# Altium schematic sheet MCU.SchDoc
size A3
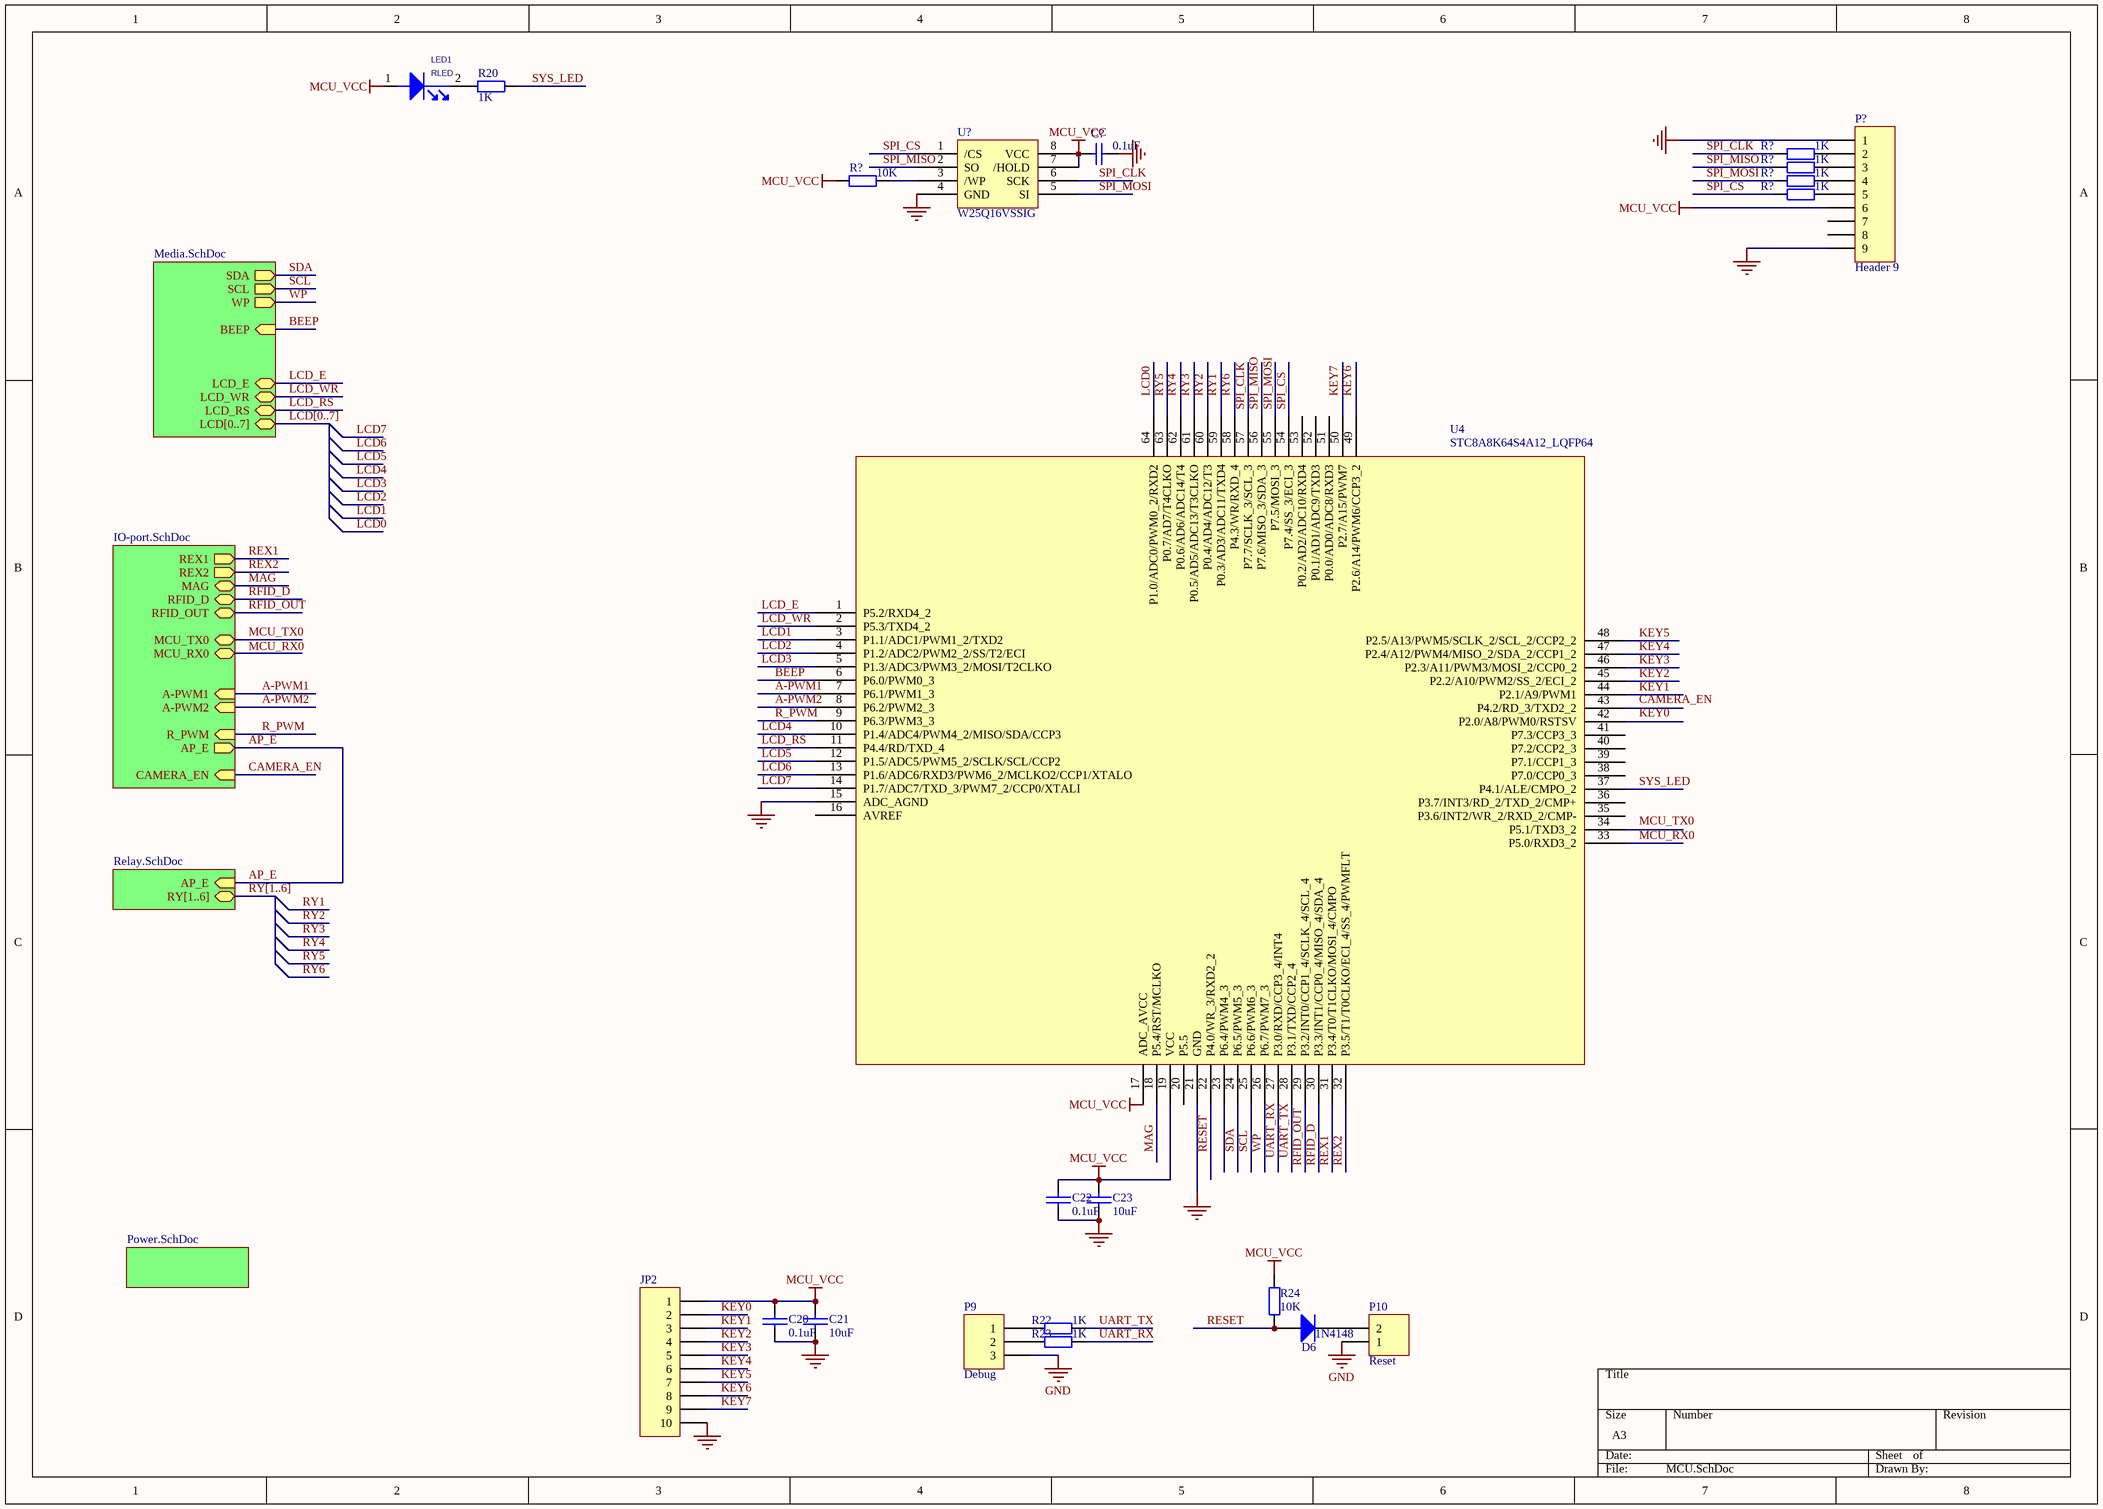
[diagram p0: MCU.SchDoc]

## Parts
(Parts that share a designator on the sheet are numbered #1, #2 ... from top to bottom, then left to right.)
C20  0.1uF  [C0603]
C21  10uF  [C0603]
C22  0.1uF  [C0603]
C23  10uF  [C0603]
C?  0.1uF  [C0603]
D6  1N4148  [SO-G2]
JP2  (no value)  [HDR1X10]
LED1  RLED  [L0603A]
P9  Debug  [HDR1X3]
P10  Reset  [HDR1X2]
P?  Header 9  [HDR1X9]
R20  value 1K  [R1608-0603]  (hidden comment: 10K)
R22  1K  [R1608-0603]
R23  1K  [R1608-0603]
R24  value 10K  [R0603]
R?#1  1K  [R0603]
R?#2  1K  [R0603]
R?#3  10K  [R0603]
R?#4  1K  [R0603]
R?#5  1K  [R0603]
U4  STC8A8K64S4A12_LQFP64  [LQFP64]
U?  W25Q16VSSIG  [SOP8L]

## Sub-sheets
IO-port = IO-port.SchDoc: REX1 (out), RFID_OUT, MAG, MCU_TX0, MCU_RX0, AP_E (out), CAMERA_EN (in), A-PWM1 (in), A-PWM2 (in), R_PWM (in), REX2 (out), RFID_D
Media = Media.SchDoc: SDA (out), SCL (out), WP (out), LCD_E (bidir), LCD_WR (bidir), LCD_RS (bidir), LCD[0..7] (bidir), BEEP (in)
Media = Power.SchDoc: no entries
Media = Relay.SchDoc: RY[1..6] (bidir), AP_E (in)

## Nets
GND: C20.2 C21.2 C22.2 C23.2 C?.1 JP2.10 P9.3 P10.1 P?.1 P?.9 U4.15(ADC_AGND) U4.21(GND) U?.4(GND)
MCU_VCC: C20.1 C21.1 C22.1 C23.1 C?.2 JP2.1 LED1.1(ANODE) P?.6 R24.1 R?#3.2 U4.17(ADC_AVCC) U4.19(VCC) U?.7(/HOLD) U?.8(VCC)
A-PWM1: U4.7(P6.1/PWM1_3) ; sheet IO-port/A-PWM1
A-PWM2: U4.8(P6.2/PWM2_3) ; sheet IO-port/A-PWM2
AP_E: sheet IO-port/AP_E, sheet Media/AP_E
BEEP: U4.6(P6.0/PWM0_3) ; sheet Media/BEEP
CAMERA_EN: sheet IO-port/CAMERA_EN
KEY0: JP2.2
KEY1: JP2.3 U4.44(P2.1/A9/PWM1)
KEY2: JP2.4 U4.45(P2.2/A10/PWM2/SS_2/ECI_2)
KEY3: JP2.5 U4.46(P2.3/A11/PWM3/MOSI_2/CCP0_2)
KEY4: JP2.6 U4.47(P2.4/A12/PWM4/MISO_2/SDA_2/CCP1_2)
KEY5: JP2.7 U4.48(P2.5/A13/PWM5/SCLK_2/SCL_2/CCP2_2)
KEY6: JP2.8
KEY7: JP2.9
LCD0: U4.64(P1.0/ADC0/PWM0_2/RXD2)
LCD1: U4.3(P1.1/ADC1/PWM1_2/TXD2)
LCD2: U4.4(P1.2/ADC2/PWM2_2/SS/T2/ECI)
LCD3: U4.5(P1.3/ADC3/PWM3_2/MOSI/T2CLKO)
LCD4: U4.10(P1.4/ADC4/PWM4_2/MISO/SDA/CCP3)
LCD5: U4.12(P1.5/ADC5/PWM5_2/SCLK/SCL/CCP2)
LCD6: U4.13(P1.6/ADC6/RXD3/PWM6_2/MCLKO2/CCP1/XTALO)
LCD7: U4.14(P1.7/ADC7/TXD_3/PWM7_2/CCP0/XTALI)
LCD_E: U4.1(P5.2/RXD4_2) ; sheet Media/LCD_E
LCD_RS: U4.11(P4.4/RD/TXD_4) ; sheet Media/LCD_RS
LCD_WR: U4.2(P5.3/TXD4_2) ; sheet Media/LCD_WR
MAG: U4.18(P5.4/RST/MCLKO) ; sheet IO-port/MAG
MCU_RX0: U4.33(P5.0/RXD3_2)
MCU_TX0: sheet IO-port/MCU_TX0
R_PWM: U4.9(P6.3/PWM3_3) ; sheet IO-port/R_PWM
RESET: D6.A R24.2 U4.22(P4.0/WR_3/RXD2_2)
REX1: U4.31(P3.4/T0/T1CLKO/MOSI_4/CMPO) ; sheet IO-port/REX1
REX2: U4.32(P3.5/T1/T0CLKO/ECI_4/SS_4/PWMFLT) ; sheet IO-port/REX2
RFID_D: U4.30(P3.3/INT1/CCP0_4/MISO_4/SDA_4) ; sheet IO-port/RFID_D
RFID_OUT: U4.29(P3.2/INT0/CCP1_4/SCLK_4/SCL_4) ; sheet IO-port/RFID_OUT
RY5: U4.63(P0.7/AD7/T4CLKO)
SCL: U4.25(P6.6/PWM6_3) ; sheet Media/SCL
SDA: U4.24(P6.5/PWM5_3) ; sheet Media/SDA
SPI_CLK: R?#1.2 U4.57(P7.7/SCLK_3/SCL_3) U?.6(SCK)
SPI_CS: R?#5.2 U?.1(/CS)
SPI_MISO: R?#2.2 U4.56(P7.6/MISO_3/SDA_3) U?.2(SO)
SPI_MOSI: R?#4.2 U?.5(SI)
SYS_LED: R20.2 U4.37(P4.1/ALE/CMPO_2)
UART_RX: R23.1 U4.27(P3.0/RXD/CCP3_4/INT4)
UART_TX: R22.1 U4.28(P3.1/TXD/CCP2_4)
WP: U4.26(P6.7/PWM7_3) ; sheet Media/WP
NetD6_K: D6.K P10.2
NetLED1_2: LED1.2(CATHODE) R20.1
NetP9_1: P9.1 R22.2
NetP9_2: P9.2 R23.2
NetP?_2: P?.2 R?#1.1
NetP?_3: P?.3 R?#2.1
NetP?_4: P?.4 R?#4.1
NetP?_5: P?.5 R?#5.1
NetR?#3_1: R?#3.1 U?.3(/WP)

Not connected (* = marked no-connect by the designer): P? 7 8; U4 16(AVREF) 20(P5.5) 23(P6.4/PWM4_3) 34(P5.1/TXD3_2) 35(P3.6/INT2/WR_2/RXD_2/CMP-) 36(P3.7/INT3/RD_2/TXD_2/CMP+) 38(P7.0/CCP0_3) 39(P7.1/CCP1_3) 40(P7.2/CCP2_3) 41(P7.3/CCP3_3) 42(P2.0/A8/PWM0/RSTSV) 43(P4.2/RD_3/TXD2_2) 49(P2.6/A14/PWM6/CCP3_2) 50(P2.7/A15/PWM7) 51(P0.0/AD0/ADC8/RXD3) 52(P0.1/AD1/ADC9/TXD3) 53(P0.2/AD2/ADC10/RXD4) 54(P7.4/SS_3/ECI_3) 55(P7.5/MOSI_3) 58(P4.3/WR/RXD_4) 59(P0.3/AD3/ADC11/TXD4) 60(P0.4/AD4/ADC12/T3) 61(P0.5/AD5/ADC13/T3CLKO) 62(P0.6/AD6/ADC14/T4)

## Buses and harness runs
bus LCD[0..7] = sheet Media/LCD[0..7]
bus RY[1..6] = sheet Media/RY[1..6]

## Notes on the sheet
- Labels drawn without touching a wire or pin: CAMERA_EN, KEY0, KEY6, KEY7, MCU_RX0, MCU_TX0, RY1, RY2, RY3, RY4, RY6, SPI_CS, SPI_MOSI

## Library data of the parts
C20-C23 = CAP: Capacitor
  C20 C22: Value: 0.1uF
  C21 C23: Value: 10uF
C? = Cap Semi: Capacitor (Semiconductor SIM Model); Published: 8-Jun-2000; LatestRevisionDate: 29-May-2009; LatestRevisionNote: IPC-7351 Footprint Added.; PackageReference: C1206; Publisher: Altium Limited; PackageDescription: Chip Capacitor; Value: 0.1uF
D6 = Diode 1N4001: 1 Amp General Purpose Rectifier; Published: 8-Jun-2000; LatestRevisionDate: 17-Jul-2002; LatestRevisionNote: Re-released for DXP Platform.; DatasheetVersion: 1998; PackageVersion: Aug-1999; PackageReference: DO-41; Publisher: Altium Limited; PackageDescription: Diode, Axial; Body 5.2 x 2.7 mm (LxDia. max), Lead Dia. 0.86 mm (max); Code_JEDEC: DO-204-AL; ComponentLink1Description: Manufacturer Link; ComponentLink1URL: http://www.fairchildsemi.com/; ComponentLink2Description: Datasheet; ComponentLink2URL: http://www.fairchildsemi.com/ds/1N%2F1N4001.pdf
JP2 = Header 10: Header, 10-Pin; LatestRevisionDate: 17-Jul-2002; LatestRevisionNote: Re-released for DXP Platform.; Publisher: Altium Limited
LED1 = LED_2
P9 = Header 3: Header, 3-Pin; LatestRevisionDate: 17-Jul-2002; LatestRevisionNote: Re-released for DXP Platform.; Publisher: Altium Limited
P10 = Header 2: Header, 2-Pin; LatestRevisionDate: 17-Jul-2002; LatestRevisionNote: Re-released for DXP Platform.; Publisher: Altium Limited
P? = Header 9: Header, 9-Pin; LatestRevisionDate: 17-Jul-2002; LatestRevisionNote: Re-released for DXP Platform.; Publisher: Altium Limited
R20 R24 R?#1-R?#5 = Res2: Resistor; Published: 8-Jun-2000; LatestRevisionDate: 17-Jul-2002; LatestRevisionNote: Re-released for DXP Platform.; PackageReference: AXIAL-0.4; Publisher: Altium Limited
  R24: PackageDescription: Axial Device, Thru-Hole; 2 Leads; 0.4 in Pin Spacing
  R?#1 R?#2 R?#4 R?#5: PackageDescription: Axial Device, Thru-Hole; 2 Leads; 0.4 in Pin Spacing; Value: 1K
  R?#3: PackageDescription: Axial Device, Thru-Hole; 2 Leads; 0.4 in Pin Spacing; Value: 10K
R22 R23 = Res2: Resistor; Value: 2.4K; Published: 8-Jun-2000; LatestRevisionDate: 17-Jul-2002; LatestRevisionNote: Re-released for DXP Platform.; PackageReference: AXIAL-0.4; Publisher: Altium Limited
U? = AT25256A: Serial EEPRom